# EAGLE design Car_PCB (EAGLE 8.4.3)
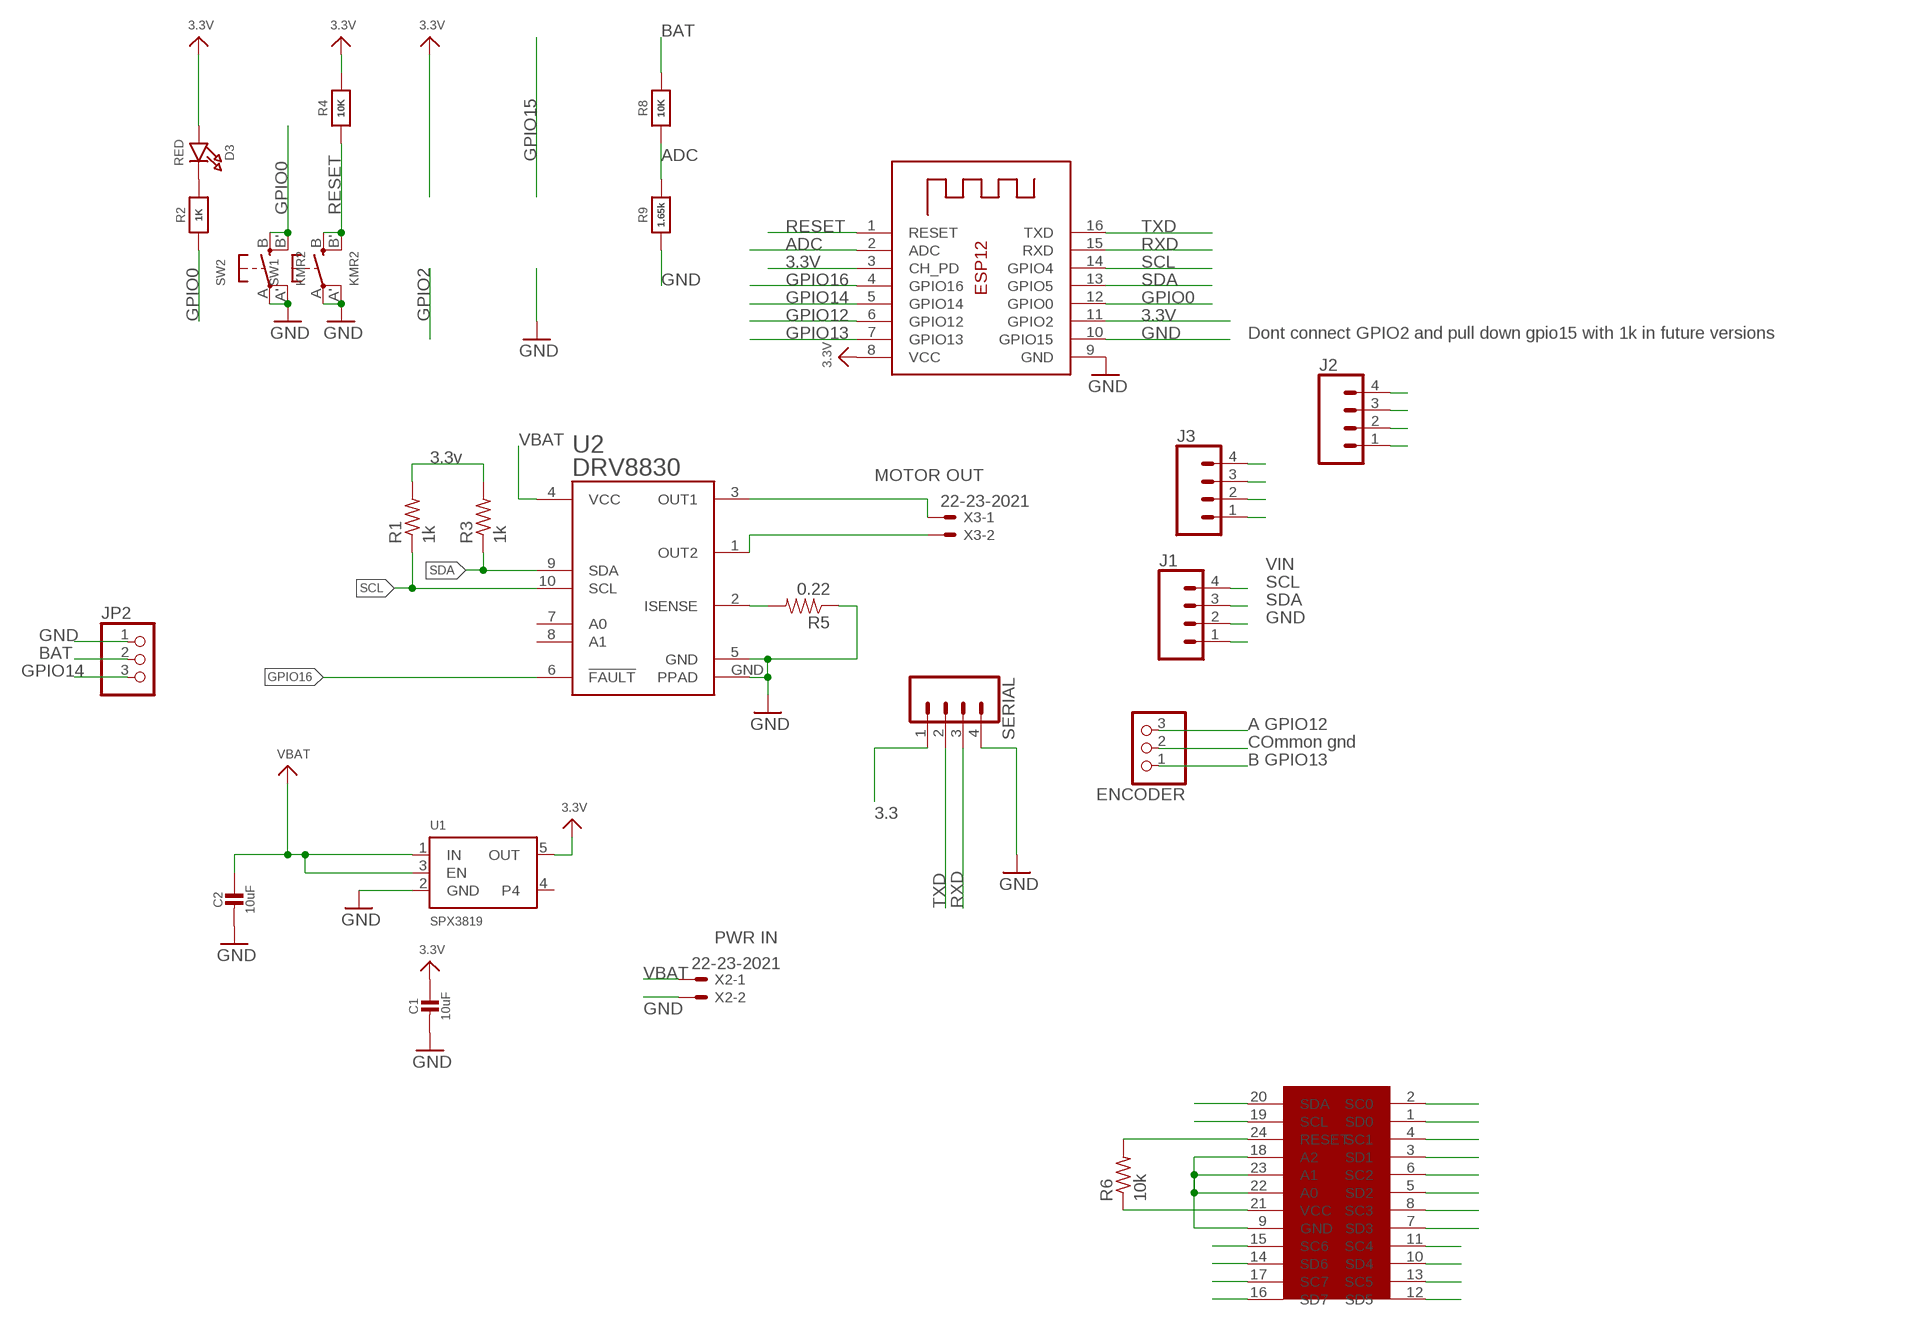
[diagram p0: schematic, sheet 1]

## Parts
C1  10uF  CAP_CERAMIC0805-NOOUTLINE  [0805-NO]
C2  10uF  CAP_CERAMIC0805-NOOUTLINE  [0805-NO]
D3  RED  LED0805_NOOUTLINE  [CHIPLED_0805_NOOUTLINE]
ENCODER  PINHD-1X3  [1X03]
J1  CONN_04  [1X04]
J2  CONN_04  [1X04]
J3  CONN_04  [1X04]
JP2  PINHD-1X3  [1X03]
R1  1k  R-US_R0805  [R0805]
R2  1K  RESISTOR0805_NOOUTLINE  [0805-NO]
R3  1k  R-US_R0805  [R0805]
R4  10K  RESISTOR0805_NOOUTLINE  [0805-NO]
R5  0.22  0.22OHM1/4W1%(0805)  [0805]
R6  10k  R-US_M0805  [M0805]
R8  10K  RESISTOR0805_NOOUTLINE  [0805-NO]
R9  1.65k  RESISTOR0805_NOOUTLINE  [0805-NO]
SERIAL  CONN_04  [1X04]
SW1  KMR2  SWITCH_TACT_SMT4.6X2.8  [BTN_KMR2_4.6X2.8]
SW2  KMR2  SWITCH_TACT_SMT4.6X2.8  [BTN_KMR2_4.6X2.8]
U1  SPX3819  VREG_SOT23-5  [SOT23-5]
U2  DRV8830  [MSOP-10-GNDPAD]
U$1  TCA9548A  [QFN24-4X4]
X1  ESP-12  [ESP-12]
X2  22-23-2021  [22-23-2021]
X3  22-23-2021  [22-23-2021]

## Nets
3.3V: C1.1 D3.A J1.4 J2.4 J3.4 R1.2 R3.2 R4.2 R6.1 SERIAL.1 U1.5(OUT) U$1.21(VCC) X1.3(CH_PD) X1.8(VCC) X1.11(GPIO2)
ADC: R8.1 R9.2 X1.2(ADC)
GND: C1.2 C2.2 ENCODER.2 J1.1 J2.1 J3.1 JP2.1 R5.1 R9.1 SERIAL.4 SW1.A'(P1) SW1.A(P) SW2.A'(P1) SW2.A(P) U1.2(GND) U2.5(GND) U2.GND(PPAD) U$1.9(GND) U$1.18(A2) U$1.22(A0) U$1.23(A1) X1.9(GND) X1.10(GPIO15) X2.2
GPIO0: R2.1 SW2.B'(S1) SW2.B(S) X1.12(GPIO0)
GPIO12: ENCODER.3 X1.6(GPIO12)
GPIO13: ENCODER.1 X1.7(GPIO13)
GPIO14: JP2.3 X1.5(GPIO14)
GPIO16: U2.6(!FAULT) X1.4(GPIO16)
MOT1: U2.3(OUT1) X3.1
MOT2: U2.1(OUT2) X3.2
N$1: D3.C R2.2
N$3: R5.2 U2.2(ISENSE)
N$5: R6.2 U$1.24(RESET)
RESET: R4.1 SW1.B'(S1) SW1.B(S) X1.1(RESET)
RXD: SERIAL.3 X1.15(RXD)
SC0: U$1.2(SC0)
SC1: U$1.4(SC1)
SC2: U$1.6(SC2)
SC3: J3.2 U$1.8(SC3)
SC4: U$1.11(SC4)
SC5: J2.2 U$1.13(SC5)
SC6: J1.2 U$1.15(SC6)
SC7: U$1.17(SC7)
SCL: R1.1 U2.10(SCL) U$1.19(SCL) X1.14(GPIO4)
SD0: U$1.1(SD0)
SD1: U$1.3(SD1)
SD2: U$1.5(SD2)
SD3: J3.3 U$1.7(SD3)
SD4: U$1.10(SD4)
SD5: J2.3 U$1.12(SD5)
SD6: J1.3 U$1.14(SD6)
SD7: U$1.16(SD7)
SDA: R3.1 U2.9(SDA) U$1.20(SDA) X1.13(GPIO5)
TXD: SERIAL.2 X1.16(TXD)
VBAT: C2.1 JP2.2 R8.2 U1.1(IN) U1.3(EN) U2.4(VCC) X2.1
Unconnected: U1.4 U2.7(A0) U2.8(A1)

## Notes on the sheet
- BAT
- ADC
- GND
- Dont connect GPIO2 and pull down gpio15 with 1k in future versions
- VBAT
- 3.3v
- MOTOR OUT
- VIN
- SCL
- SDA
- GND
- GND
- BAT
- GPIO14
- A GPIO12
- COmmon gnd
- B GPIO13
- 3.3
- PWR IN
- VBAT
- GND

## Library data of the parts
C1 C2 = microbuilder:CAP_CERAMIC: Ceramic Capacitors For new designs, use the packages preceded by an '_' character since they are more reliable: The following footprints should be used on most boards: _0402 - Standard footprint for regular board layouts _0603 - Standard footprint for regular board layouts _0805 - Standard footprint for regular board layouts _1206 - Standard footprint for regular board layouts For extremely tight-pitch boards where space is at a premium, the following 'micro-pitch' footprints can be used (smaller pads, no silkscreen outline, etc.): _0402MP - Micro-pitch footprint for very dense/compact boards _0603MP - Micro-pitch footprint for very dense/compact boards _0805MP - Micro-pitch footprint for very dense/compact boards _1206MP - Micro-pitch footprint for very dense/compact boards
D3 = microbuilder:LED: LED 0603 - 0603 Surface Mount Package 2mA: Green LED - Low Power (3.9mcd, 2ma, 1.7Vf) - Digikey: 475-2709-2-ND Orange LED - Low Power (9.8mcd, 2ma, 1.8Vf) - Digikey: 475-1194-2-ND Red LED - Low Power (5mcd, 2ma, 1.8Vf) - Digikey: 475-1195-2-ND Yellow LED - Low Power (7mcd, 2ma, 1.8Vf) - Digikey: 475-1196-2-ND 5mA: Blue LED - Low Power (17mcd, 5ma, 2.9Vf) - Digikey: LNJ937W8CRACT-ND 0805 - 0805 Surface Mount Package 2mA: Red LED (8.8mcd, 2mA, 1.8Vf, Clear) - Low Power [Digikey: 475-2510-1-ND] Green LED (5mcd, 2mA, 1.8Vf, Clear) - Low Power [Digikey: 475-2730-1-ND] Yellow LED (11.3mcd, 2mA, 1.8Vf, Clear) - Low Power [Digikey: 475-2555-1-ND] 20mA: Red LED (104mcd, 20mA, Diffused) - LS R976 [Digikey: 475-1278-6-ND] Red LED (12mcd, 20mA, 2.0Vf, Clear) - APT2012EC [Digikey: 754-1128-1-ND] Green LED (15mcd, 20mA, 2.2Vf, Clear) - APT2012GC [Digikey: 754-1131-1-ND] Orange LED (160mcd, 20mA, 2.1Vf, Clear) - APT2012SECK [Digikey: 754-1130-1-ND] 1206 - 1206 Surface Mount Package Green LED (26mcd, 20mA, Diffused) - LG N971 [Digikey: 475-1407-6-ND] Red LED (15mcd, 20mA, Diffused) - LH N974 [Digikey: 475-1416-6-ND] Cree - Cree High-Power Surface Mount LEDs XPEBWT-L1-0000-00D50 - White 111lm 350mA 2.9Vf 6200K 110° XTEAWT-00-0000-00000LEE3 - White 114lm 350mA 2.85Vf 5000K 115° Everlight - Everlight 45-21 Series Surface Mount LEDs 45-21/QK2C-B2832AC2CB2/2T - Warm White 2000mcd 20mA 3.25Vf 3050K 120° 45-21/LK2C-B38452C4CB2/2T - Nuetral White 2000mcd 20mA 3.25Vf 4150K 120° 45-21/LK2C-B50634C6CB2/2T - Cold White 2200mcd 20mA 3.25Vf 5650K 120° PLCC2 Reverse Mount LS T77K-J1L2-1-0-2-R18-Z - Red 11.25mcd 2mA 1.8Vf 630nm 120° LO T77K-L1M2-24-Z - Orange 19.6mcd 2mA 1.8Vf 606nm 120° LY T77K-K2M1-26-Z - Yellow 15.7mcd 2mA 1.8Vf 587nm 120°
ENCODER JP2 = adafruit:PINHD-1X3: PIN HEADER
J1-J3 SERIAL = SparkFun-Connectors:CONN_04: Multi connection point. Often used as Generic Header-pin footprint for 0.1 inch spaced/style header connections On any of the 0.1 inch spaced packages, you can populate with these: Break Away Headers - Straight <https://www.sparkfun.com/products/116> (PRT-00116) Break Away Male Headers - Right Angle <https://www.sparkfun.com/products/553> (PRT-00553) Female Headers <https://www.sparkfun.com/products/115> (PRT-00115) Break Away Headers - Machine Pin <https://www.sparkfun.com/products/117> (PRT-00117) Break Away Female Headers - Swiss Machine Pin <https://www.sparkfun.com/products/743> (PRT-00743) For SCREWTERMINALS and SPRING TERMINALS visit here: Screw Terimnals on SparkFun.com <https://www.sparkfun.com/search/results?term=Screw+Terminals> (5mm/3.5mm/2.54mm spacing) This device is also useful as a general connection point to wire up your design to another part of your project. Our various solder wires solder well into these plated through hole pads. Hook-Up Wire - Assortment (Stranded, 22 AWG) <https://www.sparkfun.com/products/11375> (PRT-11375) Hook-Up Wire - Assortment (Solid Core, 22 AWG) <https://www.sparkfun.com/products/11367> (PRT-11367) View the entire wire category on our website here <https://www.sparkfun.com/categories/141> Special notes: Molex polarized connector foot print use with SKU : PRT-08231 with associated crimp pins and housings. 1MM SMD Version SKU: PRT-10208; PROD_ID: CONN-09696
R1 R3 R6 = adafruit:R-US_: RESISTOR, American symbol
R2 R4 R8 R9 = microbuilder:RESISTOR: Resistors For new designs, use the packages preceded by an '_' character since they are more reliable: The following footprints should be used on most boards: _0402 - Standard footprint for regular board layouts _0603 - Standard footprint for regular board layouts _0805 - Standard footprint for regular board layouts _1206 - Standard footprint for regular board layouts For extremely tight-pitch boards where space is at a premium, the following 'micro-pitch' footprints can be used (smaller pads, no silkscreen outline, etc.): _0402MP - Micro-pitch footprint for very dense/compact boards _0603MP - Micro-pitch footprint for very dense/compact boards _0805MP - Micro-pitch footprint for very dense/compact boards _1206MP - Micro-pitch footprint for very dense/compact boards
R5 = SparkFun-Resistors:0.22OHM1/4W1%(0805): RES-09883; PROD_ID: RES-09883
SW1 SW2 = microbuilder:SWITCH_TACT_SMT: SMT Tact Switches 6x6mm - Digikey: P12940SCT-ND KMR2 (4.6x2.8mm) - Digikey: 401-1426-1-ND EVQ-PQHB55 - Light Touch, 160GF (4.5x4.5mm) - Digikey: P8090SCT-ND KMT0 - KMT021 NGJ LHS (etc.) IP68/Waterproof - Digikey: CKN10289CT-ND
U1 = microbuilder:VREG_SOT23-5: SOT23-5 Fixed Voltage Regulators Part Current Out V Out V In V Dropout θJA (°C/W) TJ (°C) Digikey Part No. ADP121 150mA 3.3V 3.4-5.5V 0.09V @ 150mA -- -- ADP121-AUJZ33R7CT-ND ADP121 150mA 3.0V 3.1-5.5V 0.09V @ 150mA -- -- ADP121-AUJZ30R7CT-ND ADP122 300mA 3.3V 3.4-5.5V 0.085V @ 300mA -- -- ADP122AUJZ-3.3-R7CT-ND ADP1712 300mA 3.3V 3.5-5.5V 0.17V @ 300mA -- -- ADP1712AUJZ-3.3-R7TR-ND AP7311 (Low Cost) 150mA 3.3V 3.5-6V 0.15V @ 150mA -- -- AP7311-33WG-7DICT-ND LD39015M18R 150mA 1.8V 1.9V-5.5V 0.08V @ 100mA -- -- 497-6977-1-ND LP2985A-33DBVR 150mA 3.3V 3.3-16V 0.28V @ 150mA 206 150 296-18479-1-ND MCP1824T-3302E/OT 300mA 3.3V 3.5V-6V 0.2V @ 300mA -- -- MCP1824T-3302E/OTCT-ND MIC5205-2.5YM5 TR 150mA 2.5V 2.7-16V 0.165V @ 150mA -- -- 576-1257-2-ND MIC5205-3.0YM5 TR 150mA 3.0V 3.2V-16V 0.165V @ 150mA -- -- 576-1258-2-ND MIC5205-3.3YM5 TR 150mA 3.3V 3.5V-16V 0.165V @ 150mA -- -- 576-1259-2-ND TPS780330220 150mA 3.3V+2.2V 3.6-5.5V 250mV Max -- -- 296-23332-1-ND TDA3663/N1,135 100mA 3.3V 3.5-45V 0.18V @ 50mA -- -- 568-5343-1-ND Max operating temp can be calculated using θJA, TJ (max junction temperature), and power in watts. Set the "Maximum Ambient Temperature" until it reaches TJ ("Max Junction Temperature"), which is the absolute limit for safe use of the regulator: Heat Sink Temperature Calculator <http://www.daycounter.com/Calculators/Heat-Sink-Temperature-Calculator.phtml> For example, With 12V source into a 3.3V LP2985 and a 30mA load, we are dissipating (12V-3.3V) * 0.03A = 0.261W. With a θJA of 206 °C/W, a TJ of 150°C, and 261mW we can safely use the chip without a heat sink up to 75°C (=147.1°C Junction Temperature).
U2 = SparkFun-PowerIC:DRV8830: DRV8830 I2C DC Motor Driver TSSOP-10 with exposed power pad 1A current limit, 2.75V to 6.8V
U$1 = si70xx-10:TCA9548A
X1 = microbuilder:ESP-12
X2 X3 = con-molex:22-23-2021: .100" (2.54mm) Center Header - 2 Pin; MF: MOLEX; MPN: 22-23-2021; OC_FARNELL: 1462926; OC_NEWARK: 25C3832

## Board
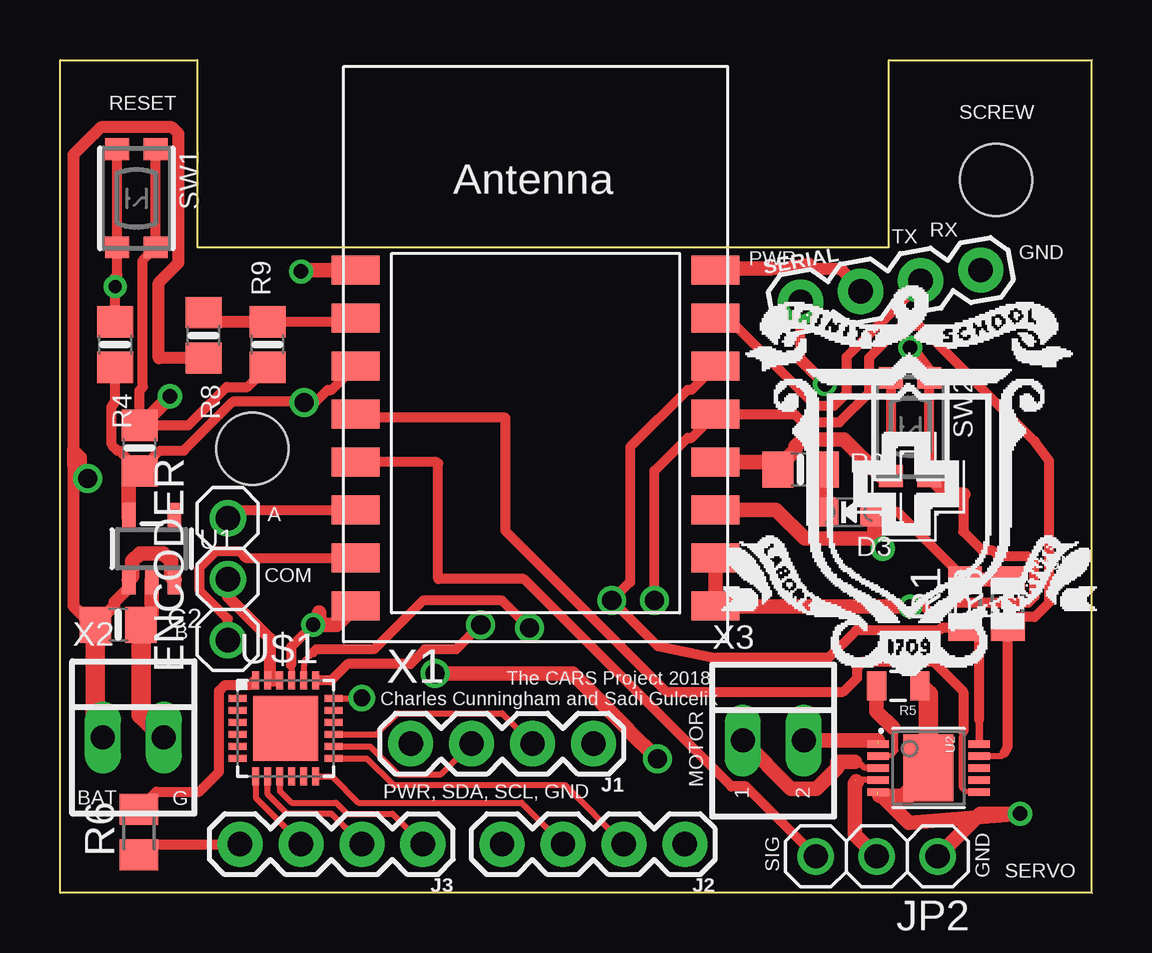
[diagram p1: board, top side]
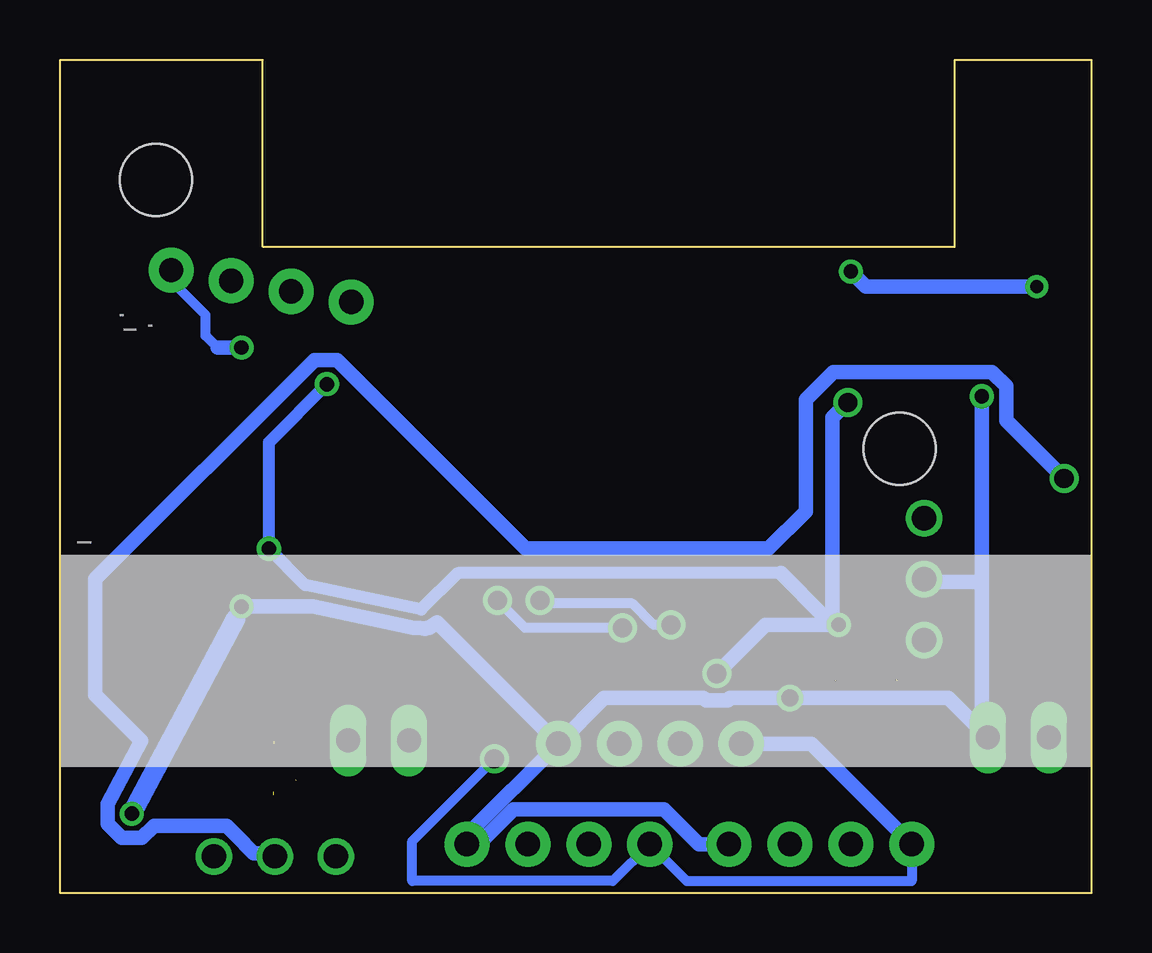
[diagram p2: board, bottom side, seen from below]

Size 43 x 34.72 mm. Coordinates in mm from the lower left corner, seen from the top.
Outline: 0,0 0,34.72 5.71,34.72 5.71,26.92 34.54,26.92 34.54,34.72 43,34.72 43,0 0,0
Copper layers (1*16): Top 0.035mm / dielectric 1.5mm / Bottom 0.035mm
Design rules "adafruit *": minimum track width 10mil, minimum drill 15.5mil, track to track 8mil, track to pad 8mil, pad to pad 8mil, via to via 8mil, smd to smd 8mil, copper to edge 10mil, drill to drill 8mil, minimum pad ring 10mil, minimum via ring 8mil, stop-mask expansion 2mil, vias tented up to drill 20mil, thermal gap 10mil
Holes 3 mm at 39,29.72 8,18.52

### Footprints (pad centres in the part's own frame; a part is rotated, then mirrored left to right if it is on the bottom)
0805-NO = smd 1.3 x 1.5: 1 -0.95,0; 2 0.95,0
CHIPLED_0805_NOOUTLINE = smd 1.2 x 1.2: A 0,-1.05; C 0,1.05
1X03 = drill 1.016: 1 -2.54,0; 2 0,0; 3 2.54,0
1X04 = drill 1.016 pad 1.88: 1 0,0; 2 2.54,0; 3 5.08,0; 4 7.62,0
R0805 = smd 1.1 x 1.4: 1 -1,0; 2 1,0
0805 = smd 0.8 x 1.2: 1 -0.9,0; 2 0.9,0
M0805 = smd 1.3 x 1.6: 1 -0.95,0; 2 0.95,0
BTN_KMR2_4.6X2.8 = smd 0.9 x 1: A 2.05,0.8; A' -2.05,0.8; B 2.05,-0.8; B' -2.05,-0.8
SOT23-5 = smd 0.55 x 1.2: 1 -0.95,-1.3; 2 0,-1.3; 3 0.95,-1.3; 4 0.95,1.3; 5 -0.95,1.3
MSOP-10-GNDPAD = smd 0.305 x 0.889: 1 -1,-2.11; 2 -0.5,-2.11; 3 0,-2.11; 4 0.5,-2.11; 5 1,-2.11; 6 1,2.11; 7 0.5,2.11; 8 0,2.11; 9 -0.5,2.11; 10 -1,2.11 | smd 2.794 x 2.083: GND 0,0
QFN24-4X4 = smd 0.75 x 0.3: 1 -2,1.25; 2 -2,0.75; 3 -2,0.25; 4 -2,-0.25; 5 -2,-0.75; 6 -2,-1.25; 13 2,-1.25; 14 2,-0.75; 15 2,-0.25; 16 2,0.25; 17 2,0.75; 18 2,1.25 | smd 0.3 x 0.75: 7 -1.25,-2; 8 -0.75,-2; 9 -0.25,-2; 10 0.25,-2; 11 0.75,-2; 12 1.25,-2; 19 1.25,2; 20 0.75,2; 21 0.25,2; 22 -0.25,2; 23 -0.75,2; 24 -1.25,2 | smd 2.7 x 2.7: EXP 0,0
ESP-12 = smd 2 x 1.2: 1 -7.5,4.5; 2 -7.5,2.5; 3 -7.5,0.5; 4 -7.5,-1.5; 5 -7.5,-3.5; 6 -7.5,-5.5; 7 -7.5,-7.5; 8 -7.5,-9.5; 9 7.5,-9.5; 10 7.5,-7.5; 11 7.5,-5.5; 12 7.5,-3.5; 13 7.5,-1.5; 14 7.5,0.5; 15 7.5,2.5; 16 7.5,4.5
22-23-2021 = drill 1 long: 1 -1.27,0; 2 1.27,0

### Placement (x,y rotation side)
C1  3.3,18.54 90 top
C2  2.41,11.18 0 top
D3  32.89,15.88 90 top
ENCODER  6.99,13.08 90 top
J1  22.23,6.22 180 top
J2  26.04,2.03 180 top
J3  15.11,2.03 180 top
JP2  34.04,1.52 180 top
R1  37.72,12.07 90 top
R2  30.86,17.65 0 top
R3  39.5,12.07 90 top
R4  2.29,22.86 270 top
R5  34.92,8.64 180 top
R6  3.28,2.54 90 top
R8  5.97,23.24 270 top
R9  8.64,22.86 90 top
SERIAL  30.86,24.64 10 top
SW1  3.17,28.96 270 top
SW2  35.43,19.43 270 top
U1  3.81,14.35 0 top
U2  36.2,5.21 270 top
U$1  9.4,6.86 0 top
U$2  [HUZZAHLOGO]  21.59,32.13 0 bottom
U$12  [ADAFRUIT_TEXT_20MM]  22.61,6.22 0 bottom
U$16  TRIN  [TRIN]  35.3,16.97 0 top
X1  19.81,21.46 0 top
X2  3.05,6.48 0 top
X3  29.72,6.35 0 top

### Tracks (layer width: path | path; a pad name or v marks a point on that pad's centre or on a via)
3.3V  (via drill 0.6, 0.8)
  Top 0.254: 9.62,9.49 9.65,9.46 U$1.21
  Top 0.406: 12.19,22.09 X1.3 11.32,20.97 11.14,20.97 10.65,20.48 10.41,20.48 | R4.2 2.29,20.45 2.15,20.31 2.15,18.67 2.38,18.44 2.46,18.44 C1.1 4.15,18.44 5.14,18.44 7.19,20.48 10.41,20.48 | 33.94,15.34 D3.A 34.91,15.88 R1.2 | 30.86,22.23 SERIAL.1 | v10.16,20.45 10.38,20.45 10.41,20.48 | 12.1,12.18 X1.8 | v10.54,11.18 9.62,10.25 9.62,9.49 | R6.1 3.72,2.03 J3.4
  Top 0.508: 10.79,11.68 10.54,11.43 v10.54,11.18 | v31.88,21.21 30.86,22.23
  Top 0.61: R1.2 R3.2 | U1.5 2.86,17.15 C1.1 | X1.8 11.53,11.18 v10.54,11.18 | 10.79,11.68 10.79,11.3 | v24.89,5.59 23.67,6.81 23.67,6.82 21.35,9.14 v15.62,9.14 | X1.11 29.84,15.96 31.03,14.77 33.87,14.77 | 33.87,14.77 v34.29,14.35 | D3.A 33.94,14.84 33.87,14.77
  Bottom 0.406: 10.79,12.19 10.79,11.43 v10.54,11.18 | J3.4 7.49,0.5 16.88,0.5 J2.4 19.95,0.5 28.32,0.5 28.32,2.16 v24.89,5.59
  Bottom 0.508: 11.18,11.56 10.79,11.18 v10.54,11.18 | v31.88,21.21 34.29,18.8 v34.29,14.35 32.77,12.84 27.94,11.81 26.42,13.34 12.95,13.34
  Bottom 0.61: 10.79,11.68 10.79,12.19 10.79,19.81 v10.16,20.45 | 11.18,11.56 12.95,13.34 | v15.62,9.14 13.59,11.18 v10.54,11.18 | J1.4 11.68,6.22 J3.4
ADC
  Top 0.406: R9.2 12.16,23.81 X1.2
  Top 0.508: R8.1 6.35,23.81 R9.2
GND  (via drill 0.6, 0.7)  (1 unrouted)
  Top 0.254: U$1.23 8.89,8.86 | 8.89,8.86 U$1.22 | 8.89,8.86 8.63,9.12 | U$1.18 12.55,8.11 v12.57,8.13 | U$1.9 9.15,4.25 9.64,3.76 11.49,3.76 11.95,3.3 13.84,3.3 J3.1
  Top 0.406: R9.1 7.82,21.09 6.94,21.09 5.34,19.49 C1.2 3.3,20.95 3.44,21.09 3.44,26.37 SW1.A SW1.A' | SW2.A SW2.A' 36.16,21.48 | 37.64,16.61 37.64,15.06 38.43,14.27 38.86,14.27 39.12,14.02 40.37,14.02 40.6,13.78 40.6,12.35 40.37,12.11 36.94,12.11 36.39,11.56 36.01,11.94 v35.43,11.94
  Top 0.508: 34.09,4.1 35.09,4.1 U2.GND 35.69,4.7 35.69,4.32 | v35.43,11.94 35.31,11.81 | 8.89,8.86 8.76,8.99 8.76,10.59 6.99,12.36 ENCODER.2
  Top 0.61: C2.2 3.81,11.62 U1.2 | C1.2 3.36,19.49 v4.57,20.7 | 34.25,4.05 35.37,2.92 v40.01,3.3 38.35,3.3 JP2.1 | 34.25,4.05 34.14,4.05 | 34.25,4.05 35.42,4.05 35.69,4.32 | 37.64,16.61 37.01,16.61 SW2.A | 36.16,21.48 36.16,21.75 v35.43,22.73 | X1.10 X1.9 27.34,11.94 v35.43,11.94
  Top 0.813: X2.2 3.36,7.43 C2.2 | U2.GND 36.2,8.27 R5.1
  Bottom 0.406: 36.43,22.73 36.93,23.23 36.93,24.09 38.37,25.53 SERIAL.4
  Bottom 0.508: 35.69,11.43 35.43,11.68 v35.43,11.94
  Bottom 0.61: 4.57,12.95 v4.57,20.7 | 4.57,12.95 4.57,6.73 X2.2 5.97,8.13 v12.57,8.13 15.07,8.13 15.16,8.03 16.08,8.03 16.18,8.13 20.32,8.13 J1.1 | v35.43,22.73 36.43,22.73 | ENCODER.2 6.86,12.95 4.57,12.95 | J1.1 26.04,2.41 J2.1 25.54,2.03 24.09,3.48 17.82,3.48 16.97,2.63 16.37,2.03 J3.1 | J1.1 27.28,11.27 27.62,11.05 27.71,11.05 27.79,11 28.02,11.05 28.26,11.05 32.45,11.94 v35.43,11.94
  Bottom 0.813: 35.69,11.43 v40.01,3.3
GPIO0
  Top 0.406: SW2.B' SW2.B
  Top 0.61: X1.12 29.6,17.96 29.88,17.69 | 29.88,17.69 R2.1 | 29.88,17.69 30.65,18.46 30.65,18.61 30.95,18.91 32.67,18.91 34.2,17.38 SW2.B
GPIO12
  Top 0.406: ENCODER.3 7.33,15.96 X1.6
GPIO13
  Top 0.406: ENCODER.1 6.99,11.43 5.82,12.6 5.82,13.57 6.5,14.25 7.47,14.25 7.75,13.96 X1.7
GPIO14
  Top 0.406: X1.5 15.69,17.96 15.75,17.91 15.75,13.08 19.32,13.08 27.97,4.44 28.58,4.44 JP2.3
GPIO16
  Top 0.216: 37.64,6.72 37.64,6.58 37.55,6.49 37.55,4.43 37.73,4.24 38.27,4.24 U2.6
  Top 0.254: U2.6 38.32,4.22
  Top 0.406: X1.4 12.46,19.81 18.54,19.81 18.54,15.11 25.27,8.38 32.64,8.38 33.22,8.96 33.22,9.4 33.46,9.64 36.39,9.64 37.64,8.39 37.64,6.72
MOT1
  Top 0.254: U2.3 34.07,5.22 33.5,5.22 33.27,5.46 33.13,5.46
  Top 0.61: X3.1 30.46,4.33 31.51,4.33 32.38,5.21 32.38,5.46 33.13,5.46
MOT2  (1 unrouted)
  Top 0.508: 34.09,6.37 34.09,6.32
  Top 0.61: 34.09,6.37 33.43,6.37 33.41,6.35 X3.2
N$1
  Top 0.61: D3.C 31.84,17.62 R2.2
N$3
  Top 0.216: U2.2 34.12,5.74 34.66,5.74 34.84,5.93 34.84,6.76 34.72,6.89
  Top 0.61: R5.2 34.02,7.58 34.72,6.89
N$5  (1 unrouted)
  Top 0.406: R6.2 4,4.22 5.79,4.22 6.62,5.04 6.62,8.43 6.86,8.66 7.9,8.66 8.09,8.86
RESET  (via drill 0.55, 0.6)
  Top 0.406: R4.1 v2.29,25.27 2.29,25.67 2.38,25.76 SW1.B SW1.B'
  Top 0.61: X1.1 10.09,25.96 v10.03,25.91
  Bottom 0.61: v2.29,25.27 9.4,25.27 v10.03,25.91
RXD
  Top 0.406: 27.4,23.88 27.92,23.88 31.5,20.3 32.25,20.3 32.79,20.83 32.79,22.35 35.86,25.43 SERIAL.3
  Top 0.61: 27.4,23.88 X1.15
SC3
  Top 0.254: J3.2 11.3,3.3 9.45,3.3 8.65,4.1 U$1.8
SC5
  Top 0.254: U$1.13 12.78,5.61 13.89,4.5 21.03,4.5 J2.2
SC6
  Top 0.254: U$1.15 13.19,6.61 14.08,7.49 18.41,7.49 J1.2
SCL  (via drill 0.8)  (1 unrouted)
  Top 0.305: U2.10 38.3,7.23
  Top 0.406: 38.3,7.23 38.3,10.58 37.79,11.09 | R1.1 36.76,11.07 36.64,10.95 33.18,10.95 32.02,9.79 27.31,9.79 24.89,10.31 23,12.19 v22.99,12.19 23.75,12.96 23.75,18.58 26.14,20.97 26.32,20.97 X1.14 | v17.53,11.18 16.5,10.15 15.2,10.15 14.59,9.55 11.99,9.55 11.3,8.86 10.7,8.86
  Top 0.508: R1.1 37.77,11.07 37.79,11.09
  Bottom 0.406: v17.53,11.18 18.26,11.18 19.14,12.06 22.85,12.06 v22.99,12.19
SD3
  Top 0.254: U$1.7 8.17,4.84 8.17,3.94 10.03,2.07 J3.3
SD5
  Top 0.254: U$1.12 11.32,4.86 12.42,3.76 19.23,3.76 J2.3
SD6
  Top 0.254: U$1.14 12.92,6.11 14.08,4.95 15.88,4.95 J1.3
SDA  (via drill 0.8)
  Top 0.254: U2.9 39.23,5.71 39.37,5.84 | 10.54,10.03 10.17,9.67 10.17,9.49 10.15,9.46 U$1.20
  Top 0.406: 39.37,5.84 39.5,6.1 R3.1 39.93,11.5 40.62,11.5 41.21,12.09 41.21,18.03 40.6,18.85 35.81,23.64 35.06,23.64 33.73,22.31 33.73,20.86 32.49,19.62 30.94,19.62 30.6,19.96 X1.13 26.32,18.97 26.14,18.97 24.77,17.59 v24.77,12.19 | v19.56,11.05 18.41,12.19 15.11,12.19 13.08,10.16 10.67,10.16 10.54,10.03
  Bottom 0.406: v19.56,11.05 23.62,11.05 v24.77,12.19
TXD
  Top 0.508: 29.59,26.04 30.05,26.04 31.19,26.24 31.48,26.04 32.53,26.04 SERIAL.2
  Top 0.61: 29.59,26.04 27.38,26.04 X1.16
VBAT  (via drill 0.8)  (1 unrouted)
  Top 0.254: U2.4 33.16,4.71 33.15,4.7
  Top 0.406: 0.55,18.54 0.91,18.18 0.91,17.51 v1.14,17.27 0.64,17.78 0.55,17.78
  Top 0.508: C2.1 2.26,11.97 2.26,12.11 2.86,12.72 U1.1 | R8.2 4.1,22.29 4.1,25.44 4.93,26.27 4.93,31.64 4.66,31.91 1.69,31.91 1.42,31.64 0.55,30.77 0.55,18.54 0.55,17.78 0.55,11.97 1.46,11.05 | 33.2,4.63 33.16,4.67 33.16,4.7 33.2,4.7
  Top 0.61: U1.3 4.62,13.19 4.62,13.83 4.29,14.16 3.33,14.16 3,13.83 3,13.19 U1.1 | 33.2,4.63 33.13,4.57 33.13,2.43 JP2.2 | 0.6,17.27 v1.14,17.27
  Top 0.813: X2.1 1.46,6.79 1.46,11.05 C2.1
  Bottom 0.508: 1.85,6.48 X2.1
  Bottom 0.61: JP2.2 34.16,1.65 34.92,1.65 35.31,2.03 35.31,2.05 36.05,2.79 39.08,2.79 39.59,2.29 40.42,2.29 41.02,2.88 41.02,3.72 39.62,6.35 41.53,8.25 41.53,13.08 32.39,22.22 31.46,22.22 23.59,14.35 13.46,14.35 11.91,15.91 11.91,20.56 10.75,21.71 4.15,21.71 3.56,21.12 3.56,19.69 v1.14,17.27

### Text on the board
tPlace: RESET | SCREW | TX | RX | PWR | GND | A | GND | COM | B | The CARS Project 2018 / Charles Cunningham and Sadi Gulcelik | MOTOR | BAT | G | PWR, SDA, SCL, GND | 1 | 2 | SIG | GND | SERVO